# EAGLE design InterfazSensores (EAGLE 7.6.0)
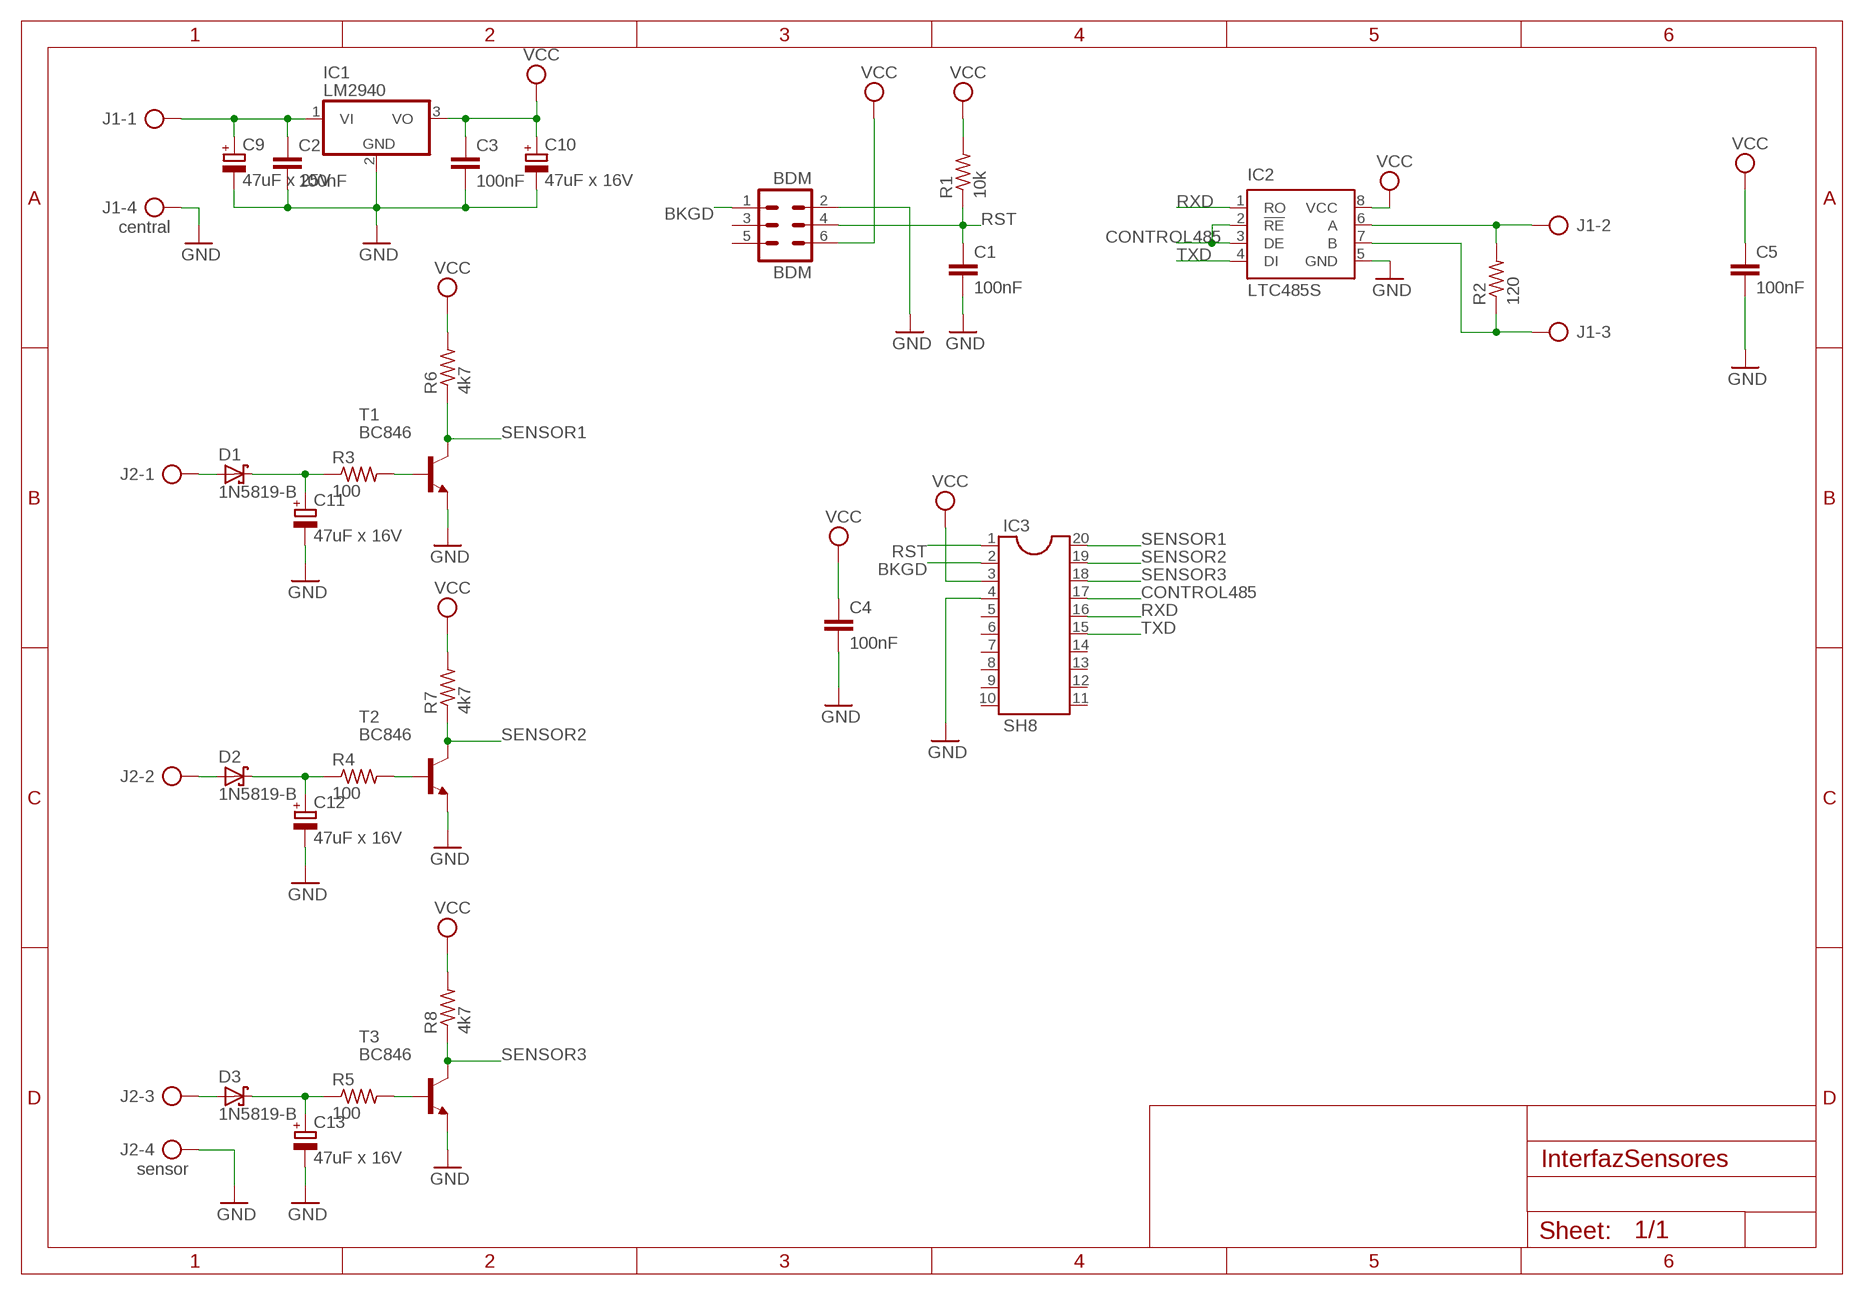
[diagram p0: schematic, sheet 1]

## Parts
BDM  BDM  MA03-2  [MA03-2]
C1  100nF  C-EUC0805  [C0805]
C2  100nF  C-EUC0805  [C0805]
C3  100nF  C-EUC0805  [C0805]
C4  100nF  C-EUC0805  [C0805]
C5  100nF  C-EUC0805  [C0805]
C9  47uF x 25V  CPOL-EUE2,5-6E  [E2,5-6E]
C10  47uF x 16V  CPOL-EUE2,5-6E  [E2,5-6E]
C11  47uF x 16V  CPOL-EUE2,5-6E  [E2,5-6E]
C12  47uF x 16V  CPOL-EUE2,5-6E  [E2,5-6E]
C13  47uF x 16V  CPOL-EUE2,5-6E  [E2,5-6E]
D1  1N5819-B  [DO41-7.6]
D2  1N5819-B  [DO41-7.6]
D3  1N5819-B  [DO41-7.6]
IC1  LM2940  7805TV  [TO220V]
IC2  LTC485S  [SOIC8]
IC3  SH8  DIL20  [DIL20]
J1  central  AK300/4  [AK300/4]
J2  sensor  AK300/4  [AK300/4]
R1  10k  R-US_R0805  [R0805]
R2  120  R-US_R0805  [R0805]
R3  100  R-US_R0805  [R0805]
R4  100  R-US_R0805  [R0805]
R5  100  R-US_R0805  [R0805]
R6  4k7  R-US_R0805  [R0805]
R7  4k7  R-US_R0805  [R0805]
R8  4k7  R-US_R0805  [R0805]
T1  BC846  [SOT23]
T2  BC846  [SOT23]
T3  BC846  [SOT23]

## Nets
BKGD: BDM.1 IC3.2
CONTROL485: IC2.2(!RE) IC2.3(DE) IC3.17
GND: BDM.2 C1.2 C2.2 C3.2 C4.2 C5.2 C9.- C10.- C11.- C12.- C13.- IC1.2(GND) IC2.5(GND) IC3.4 J1.4 J2.4 T1.2(E) T2.2(E) T3.2(E)
N$1: C2.1 C9.+ IC1.1(VI) J1.1
N$2: IC2.6(A) J1.2 R2.2
N$3: IC2.7(B) J1.3 R2.1
N$4: D1.A J2.1
N$5: D2.A J2.2
N$6: D3.A J2.3
N$7: C11.+ D1.C R3.1
N$8: C12.+ D2.C R4.1
N$9: C13.+ D3.C R5.1
N$10: R5.2 T3.1(B)
N$12: R4.2 T2.1(B)
N$14: R3.2 T1.1(B)
RST: BDM.4 C1.1 IC3.1 R1.1
RXD: IC2.1(RO) IC3.16
SENSOR1: IC3.20 R6.1 T1.3(C)
SENSOR2: IC3.19 R7.1 T2.3(C)
SENSOR3: IC3.18 R8.1 T3.3(C)
TXD: IC2.4(DI) IC3.15
VCC: BDM.6 C3.1 C4.1 C5.1 C10.+ IC1.3(VO) IC2.8(VCC) IC3.3 R1.2 R6.2 R7.2 R8.2
Unconnected: BDM.3 BDM.5 IC3.5 IC3.6 IC3.7 IC3.8 IC3.9 IC3.10 IC3.11 IC3.12 IC3.13 IC3.14

## Library data of the parts
BDM = con-lstb:MA03-2: PIN HEADER; OC_FARNELL: unknown; OC_NEWARK: unknown
C1-C5 = resistor:C-EU: CAPACITOR, European symbol
C9-C13 = rcl:CPOL-EU: POLARIZED CAPACITOR, European symbol
D1-D3 = diode:1N581*: 1.0A SCHOTTKY BARRIER RECTIFIER Source: http://www.diodes.com/datasheets/ds23001.pdf
IC1 = linear:78*: Positive VOLTAGE REGULATOR Source: http://cache.national.com/ds/LM/LM78L05.pdf http://www.fairchildsemi.com/ds/LM/LM7805.pdf
IC2 = linear-technology:LTC485: Low Power RS485 Interface Transceiver Source: http://www.linear.com/pc/downloadDocument.do?navId=H0,C1,C1007,C1017,P2064,D1718; OC_FARNELL: unknown; OC_NEWARK: unknown
IC3 = ic-package:DIL20: Dual In Line / Socket
J1 J2 = con-ptr500:AK300/4: CONNECTOR; OC_FARNELL: unknown; OC_NEWARK: unknown
R1-R8 = resistor:R-US_: RESISTOR, American symbol
T1-T3 = transistor:BC846: NPN TRANSISTOR

## Board
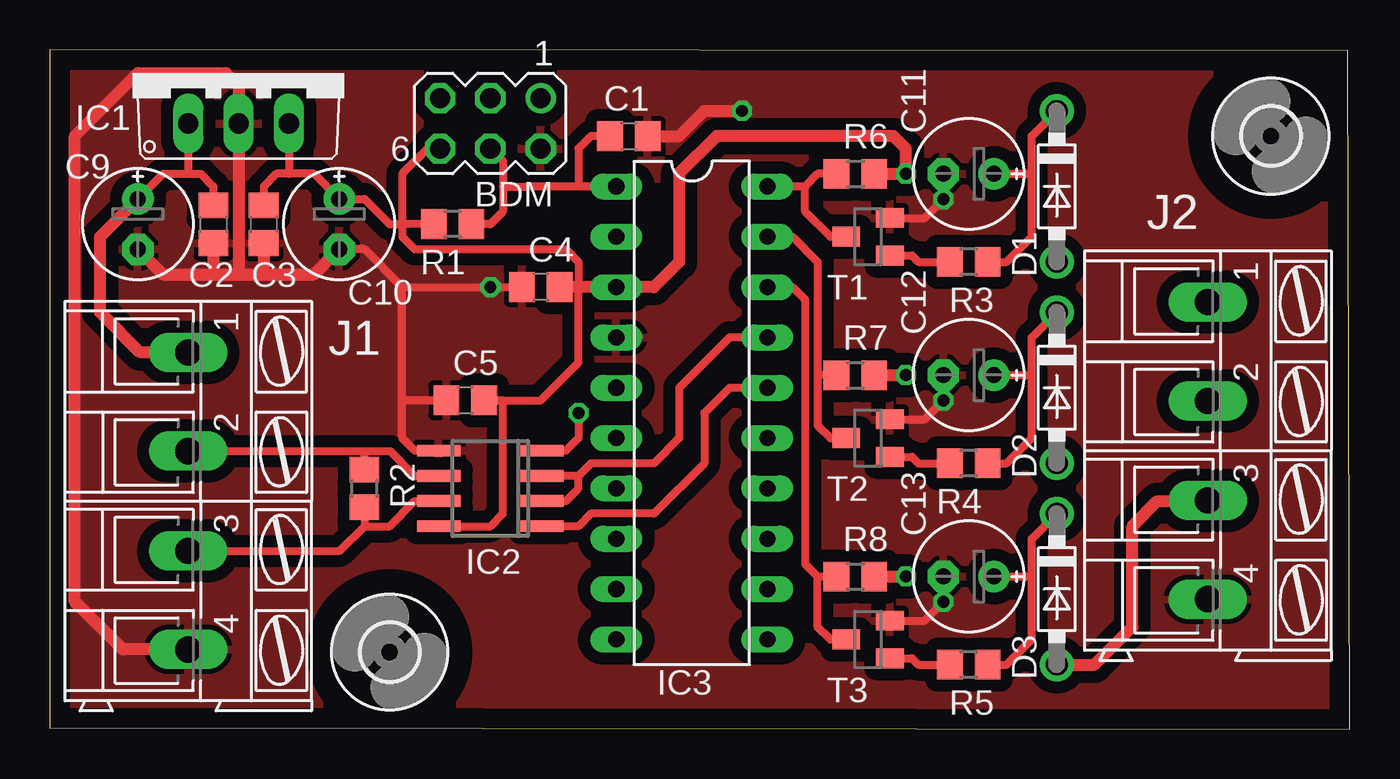
[diagram p1: board, top side]
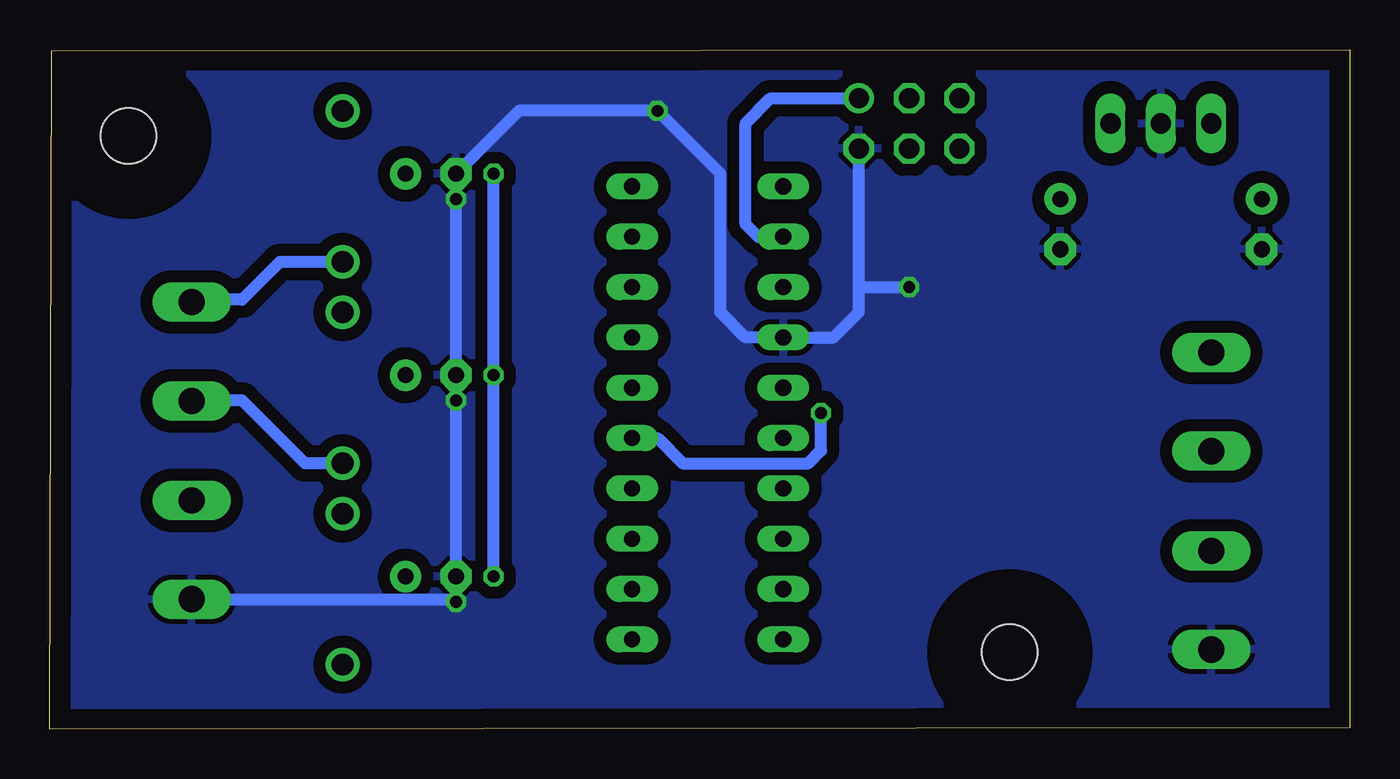
[diagram p2: board, bottom side, seen from below]

Size 65.59 x 34.3 mm. Coordinates in mm from the lower left corner, seen from the top.
Outline: 0,34.3 0.01,0.09 65.59,0 65.5,34.25 0,34.3
Copper layers (1*16): Top 0.035mm / dielectric 1.5mm / Bottom 0.035mm
Design rules "default *": minimum track width 10mil, minimum drill 24mil, track to track 8mil, track to pad 8mil, pad to pad 8mil, via to via 8mil, smd to smd 8mil, copper to edge 40mil, drill to drill 8mil, minimum pad ring 10mil, minimum via ring 8mil, stop-mask expansion 4mil, vias tented up to drill 24mil, thermal gap 10mil

### Footprints (pad centres in the part's own frame; a part is rotated, then mirrored left to right if it is on the bottom)
MA03-2 = drill 1.016: 1 -2.54,-1.27 | drill 1.016 octagon: 2 -2.54,1.27; 3 0,-1.27; 4 0,1.27; 5 2.54,-1.27; 6 2.54,1.27
C0805 = smd 1.3 x 1.5: 1 -0.95,0; 2 0.95,0
E2,5-6E = drill 0.813 pad 1.575: + -1.27,0 | drill 0.813 pad 1.575 octagon: - 1.27,0
DO41-7.6 = drill 1.1 pad 1.7: A 3.81,0; C -3.81,0
TO220V = drill 1.016 long: 1 -2.54,-2.54; 2 0,-2.54; 3 2.54,-2.54
SOIC8 = smd 0.6 x 2.2: 1 -1.905,-2.6; 2 -0.635,-2.6; 3 0.635,-2.6; 4 1.905,-2.6; 5 1.905,2.6; 6 0.635,2.6; 7 -0.635,2.6; 8 -1.905,2.6
DIL20 = drill 0.813 long: 1 -11.43,-3.81; 2 -8.89,-3.81; 3 -6.35,-3.81; 4 -3.81,-3.81; 5 -1.27,-3.81; 6 1.27,-3.81; 7 3.81,-3.81; 8 6.35,-3.81; 9 8.89,-3.81; 10 11.43,-3.81; 11 11.43,3.81; 12 8.89,3.81; 13 6.35,3.81; 14 3.81,3.81; 15 1.27,3.81; 16 -1.27,3.81; 17 -3.81,3.81; 18 -6.35,3.81; 19 -8.89,3.81; 20 -11.43,3.81
AK300/4 = drill 1.321 long: 1 -7.493,0; 2 -2.515,0; 3 2.515,0; 4 7.493,0
R0805 = smd 1.3 x 1.5: 1 -0.95,0; 2 0.95,0
SOT23 = smd 1 x 1.4: 1 -0.95,-1.1; 2 0.95,-1.1; 3 0,1.1
2,8 = hole 2.8: 0,0

### Placement (x,y rotation side)
BDM  22.24,30.57 180 top
C1  29.22,29.93 0 top
C2  8.27,25.49 270 top
C3  10.8,25.49 270 top
C4  24.78,22.32 180 top
C5  20.96,16.6 180 top
C9  4.46,25.49 270 top
C10  14.62,25.49 270 top
C11  46.36,28.03 180 top
C12  46.36,17.87 180 top
C13  46.36,7.71 180 top
D1  50.81,27.39 270 top
D2  50.81,17.23 270 top
D3  50.81,7.08 270 top
IC1  9.54,33.11 0 top
IC2  22.24,12.15 90 top
IC3  32.39,15.96 270 top
J1  7,11.52 270 top
J2  58.43,14.06 270 top
R1  20.33,25.49 180 top
R2  15.88,12.15 90 top
R3  46.36,23.59 180 top
R4  46.36,13.43 180 top
R5  46.36,3.26 180 top
R6  40.65,28.03 0 top
R7  40.65,17.87 0 top
R8  40.65,7.71 0 top
T1  41.28,24.86 90 top
T2  41.28,14.7 90 top
T3  41.28,4.54 90 top
U$1  [2,8]  61.6,29.93 270 top
U$3  [2,8]  17.16,3.9 270 top

### Tracks (layer width: path | path; a pad name or v marks a point on that pad's centre or on a via)
BKGD
  Bottom 0.61: IC3.2 29.86,24.86 30.49,25.49 30.49,30.57 29.22,31.84 BDM.1
CONTROL485
  Top 0.406: 26.68,12.79 27.32,13.43 30.49,13.43 31.76,14.7 31.76,17.23 34.3,19.77 IC3.17 | 26.68,12.79 IC2.3 | IC2.2 26.05,11.52 26.68,12.15 26.68,12.79
GND  (via drill 0.6)
  Top 0.406: T3.2 44.14,5.48 v45.09,6.44 C13.- | T2.2 44.14,15.64 v45.09,16.6 C12.- | T1.2 44.14,25.8 v45.09,26.76 C11.- | IC2.5 18.43,14.06 17.79,14.7 17.79,16.6 | C5.2 17.79,16.6 | 17.79,16.6 17.79,22.32 | 17.79,22.32 15.88,24.22 C10.- | 17.79,22.32 v22.24,22.32 C4.2
  Top 0.61: C9.- 5.72,22.95 8.27,22.95 | 8.27,22.95 9.54,22.95 | 9.54,22.95 10.8,22.95 | 10.8,22.95 13.35,22.95 C10.- | C3.2 10.8,22.95 | C2.2 8.27,22.95 | C1.2 31.76,29.93 33.03,31.2 v34.93,31.2 | J1.4 3.69,4.03 1.28,6.44 1.28,29.93 4.46,33.11 8.9,33.11 9.54,32.48 IC1.2 9.54,22.95
  Bottom 0.61: J2.4 45.22,6.57 v45.09,6.44 | C13.- v45.09,6.44 | v45.09,6.44 v45.09,16.6 C12.- v45.09,26.76 C11.- 41.92,31.2 v34.93,31.2 31.76,28.03 31.76,21.04 30.49,19.77 IC3.4 26.05,19.77 24.78,21.04 24.78,22.32 | 24.78,22.32 BDM.2 | 24.78,22.32 v22.24,22.32
  pour Top (isolate 0.61): 0.65,0.72 64.78,0.72 64.78,33.75 0.65,33.75
  pour Bottom (isolate 0.61): 0.65,33.75 0.65,0.72 64.78,0.72 64.78,33.75
N$1
  Top 0.406: C9.+ 5.72,28.03 7,28.03 | 7,28.03 7.63,28.03 8.27,27.39 C2.1 | IC1.1 7,28.03
  Top 0.61: J1.1 4.58,19.01 2.55,21.04 2.55,24.86 C9.+
N$2
  Top 0.406: J1.2 15.88,14.04 | 15.88,14.04 17.18,14.04 18.43,12.79 IC2.6 | R2.2 15.88,14.04
N$3
  Top 0.406: J1.3 14.64,9 15.88,10.25 | 15.88,10.25 17.16,10.25 18.43,11.52 IC2.7 | R2.1 15.88,10.25
N$4
  Bottom 0.61: D1.A 53.98,23.59 55.89,21.68 58.3,21.68 J2.1
N$5
  Bottom 0.61: D2.A 52.71,13.43 55.89,16.6 58.41,16.6 J2.2
N$6
  Top 0.61: D3.A 52.71,3.26 54.62,5.17 54.62,10.25 55.89,11.52 58.41,11.52 J2.3
N$7
  Top 0.406: R3.1 48.27,23.59 49.54,24.86 49.54,28.03 | 49.54,28.03 49.54,29.93 D1.C | C11.+ 49.54,28.03
N$8
  Top 0.406: R4.1 48.27,13.43 49.54,14.7 49.54,17.87 | 49.54,17.87 49.54,19.77 D2.C | C12.+ 49.54,17.87
N$9
  Top 0.406: R5.1 48.27,3.26 49.54,4.54 49.54,7.71 | 49.54,7.71 49.54,9.62 D3.C | C13.+ 49.54,7.71
N$10
  Top 0.406: T3.1 43.5,3.58 43.82,3.26 R5.2
N$12
  Top 0.406: T2.1 43.5,13.74 43.82,13.43 R4.2
N$14
  Top 0.406: T1.1 43.5,23.91 43.82,23.59 R3.2
RST
  Top 0.406: 21.6,25.49 R1.1 22.24,25.49 22.87,26.12 22.87,27.39 | IC3.1 26.68,27.39 | 26.68,27.39 24.14,27.39 22.87,27.39 | BDM.4 22.87,28.66 22.87,27.39 | C1.1 27.32,29.93 26.68,29.3 26.68,27.39
RXD
  Top 0.406: IC2.1 26.68,10.25 27.32,10.88 30.49,10.88 33.03,13.43 33.03,15.96 34.3,17.23 IC3.16
SENSOR1
  Top 0.406: T1.3 39.38,24.86 38.11,26.12 38.11,27.39 | 38.11,27.39 IC3.20 | R6.1 38.74,28.03 38.11,27.39
SENSOR2
  Top 0.406: IC3.19 37.48,24.86 38.74,23.59 38.74,17.87 | 38.74,17.87 38.74,15.33 39.38,14.7 T2.3 | R7.1 38.74,17.87
SENSOR3
  Top 0.406: 38.74,7.71 38.43,8.03 38.11,8.35 38.11,21.68 37.48,22.32 IC3.18 | 38.74,7.71 R8.1 | T3.3 39.38,4.54 38.74,5.17 38.74,7.71
TXD  (via drill 0.6)
  Top 0.406: v26.68,15.96 26.68,14.7 26.05,14.06 IC2.4
  Bottom 0.61: IC3.15 34.93,14.7 33.66,13.43 27.32,13.43 26.68,14.06 v26.68,15.96
VCC  (via drill 0.6)
  Top 0.406: 12.07,28.03 13.35,28.03 C10.+ 15.88,26.76 17.16,25.49 17.79,25.49 | 12.07,28.03 11.44,28.03 10.8,27.39 C3.1 | IC1.3 12.07,28.03 | BDM.6 19.06,29.3 17.79,28.03 17.79,25.49 | R1.2 17.79,25.49 | 17.79,25.49 17.79,24.86 18.43,24.22 26.05,24.22 26.68,23.59 26.68,22.32 26.68,18.5 24.78,16.6 C5.1 22.87,16.6 22.87,10.88 22.24,10.25 IC2.8
  Top 0.61: R6.2 v43.19,28.03 43.19,29.3 42.55,29.93 33.66,29.93 31.76,28.03 31.76,23.59 30.49,22.32 IC3.3 26.68,22.32 C4.1 | R8.2 v43.19,7.71 | R7.2 v43.19,17.87
  Bottom 0.61: v43.19,7.71 v43.19,17.87 v43.19,28.03